# Altium schematic sheet SchemaSplit_2_into_1_1.SchDoc
size A4; SheetNumber: 1; SheetTotal: 1
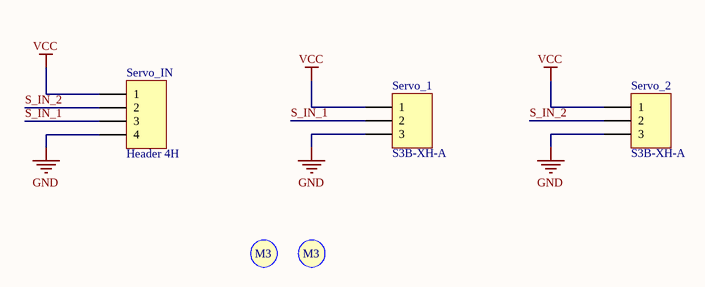
[diagram p0: SchemaSplit_2_into_1_1.SchDoc]

## Parts
S1  Screw M3  [Screw M3]  (value not drawn)
S2  Screw M3  [Screw M3]  (value not drawn)
Servo_1  S3B-XH-A  [S3B-XH-A]
Servo_2  S3B-XH-A  [S3B-XH-A]
Servo_IN  Header 4H  [S4B-XH-A]

## Nets
GND: Servo_1.3 Servo_2.3 Servo_IN.4
VCC: Servo_1.1 Servo_2.1 Servo_IN.1
S_IN_1: Servo_1.2 Servo_IN.3
S_IN_2: Servo_2.2 Servo_IN.2

## Notes on the sheet
- (in symbol Screw M3) M3

## Library data of the parts
Servo_1 Servo_2 = Header 3H: Header, 3-Pin, Right Angle; LatestRevisionDate: 17-Jul-2002; LatestRevisionNote: Re-released for DXP Platform.; Publisher: Altium Limited
Servo_IN = Header 4H: Header, 4-Pin, Right Angle; LatestRevisionDate: 17-Jul-2002; LatestRevisionNote: Re-released for DXP Platform.; Publisher: Altium Limited